# EasyEDA Pro project ProProject_New Project_2023-08-26_19-08-02_2023-08-26.epro

# Schematic Schematic1
Create Date: 2023-08-26; Page Name: P1; Project Name: New Project_2023-08-26_19-08-02; Schematic Name: Schematic1; Update Date: 2023-08-26; Company: 嘉立创EDA; Page Size: A4; Version: V1.0
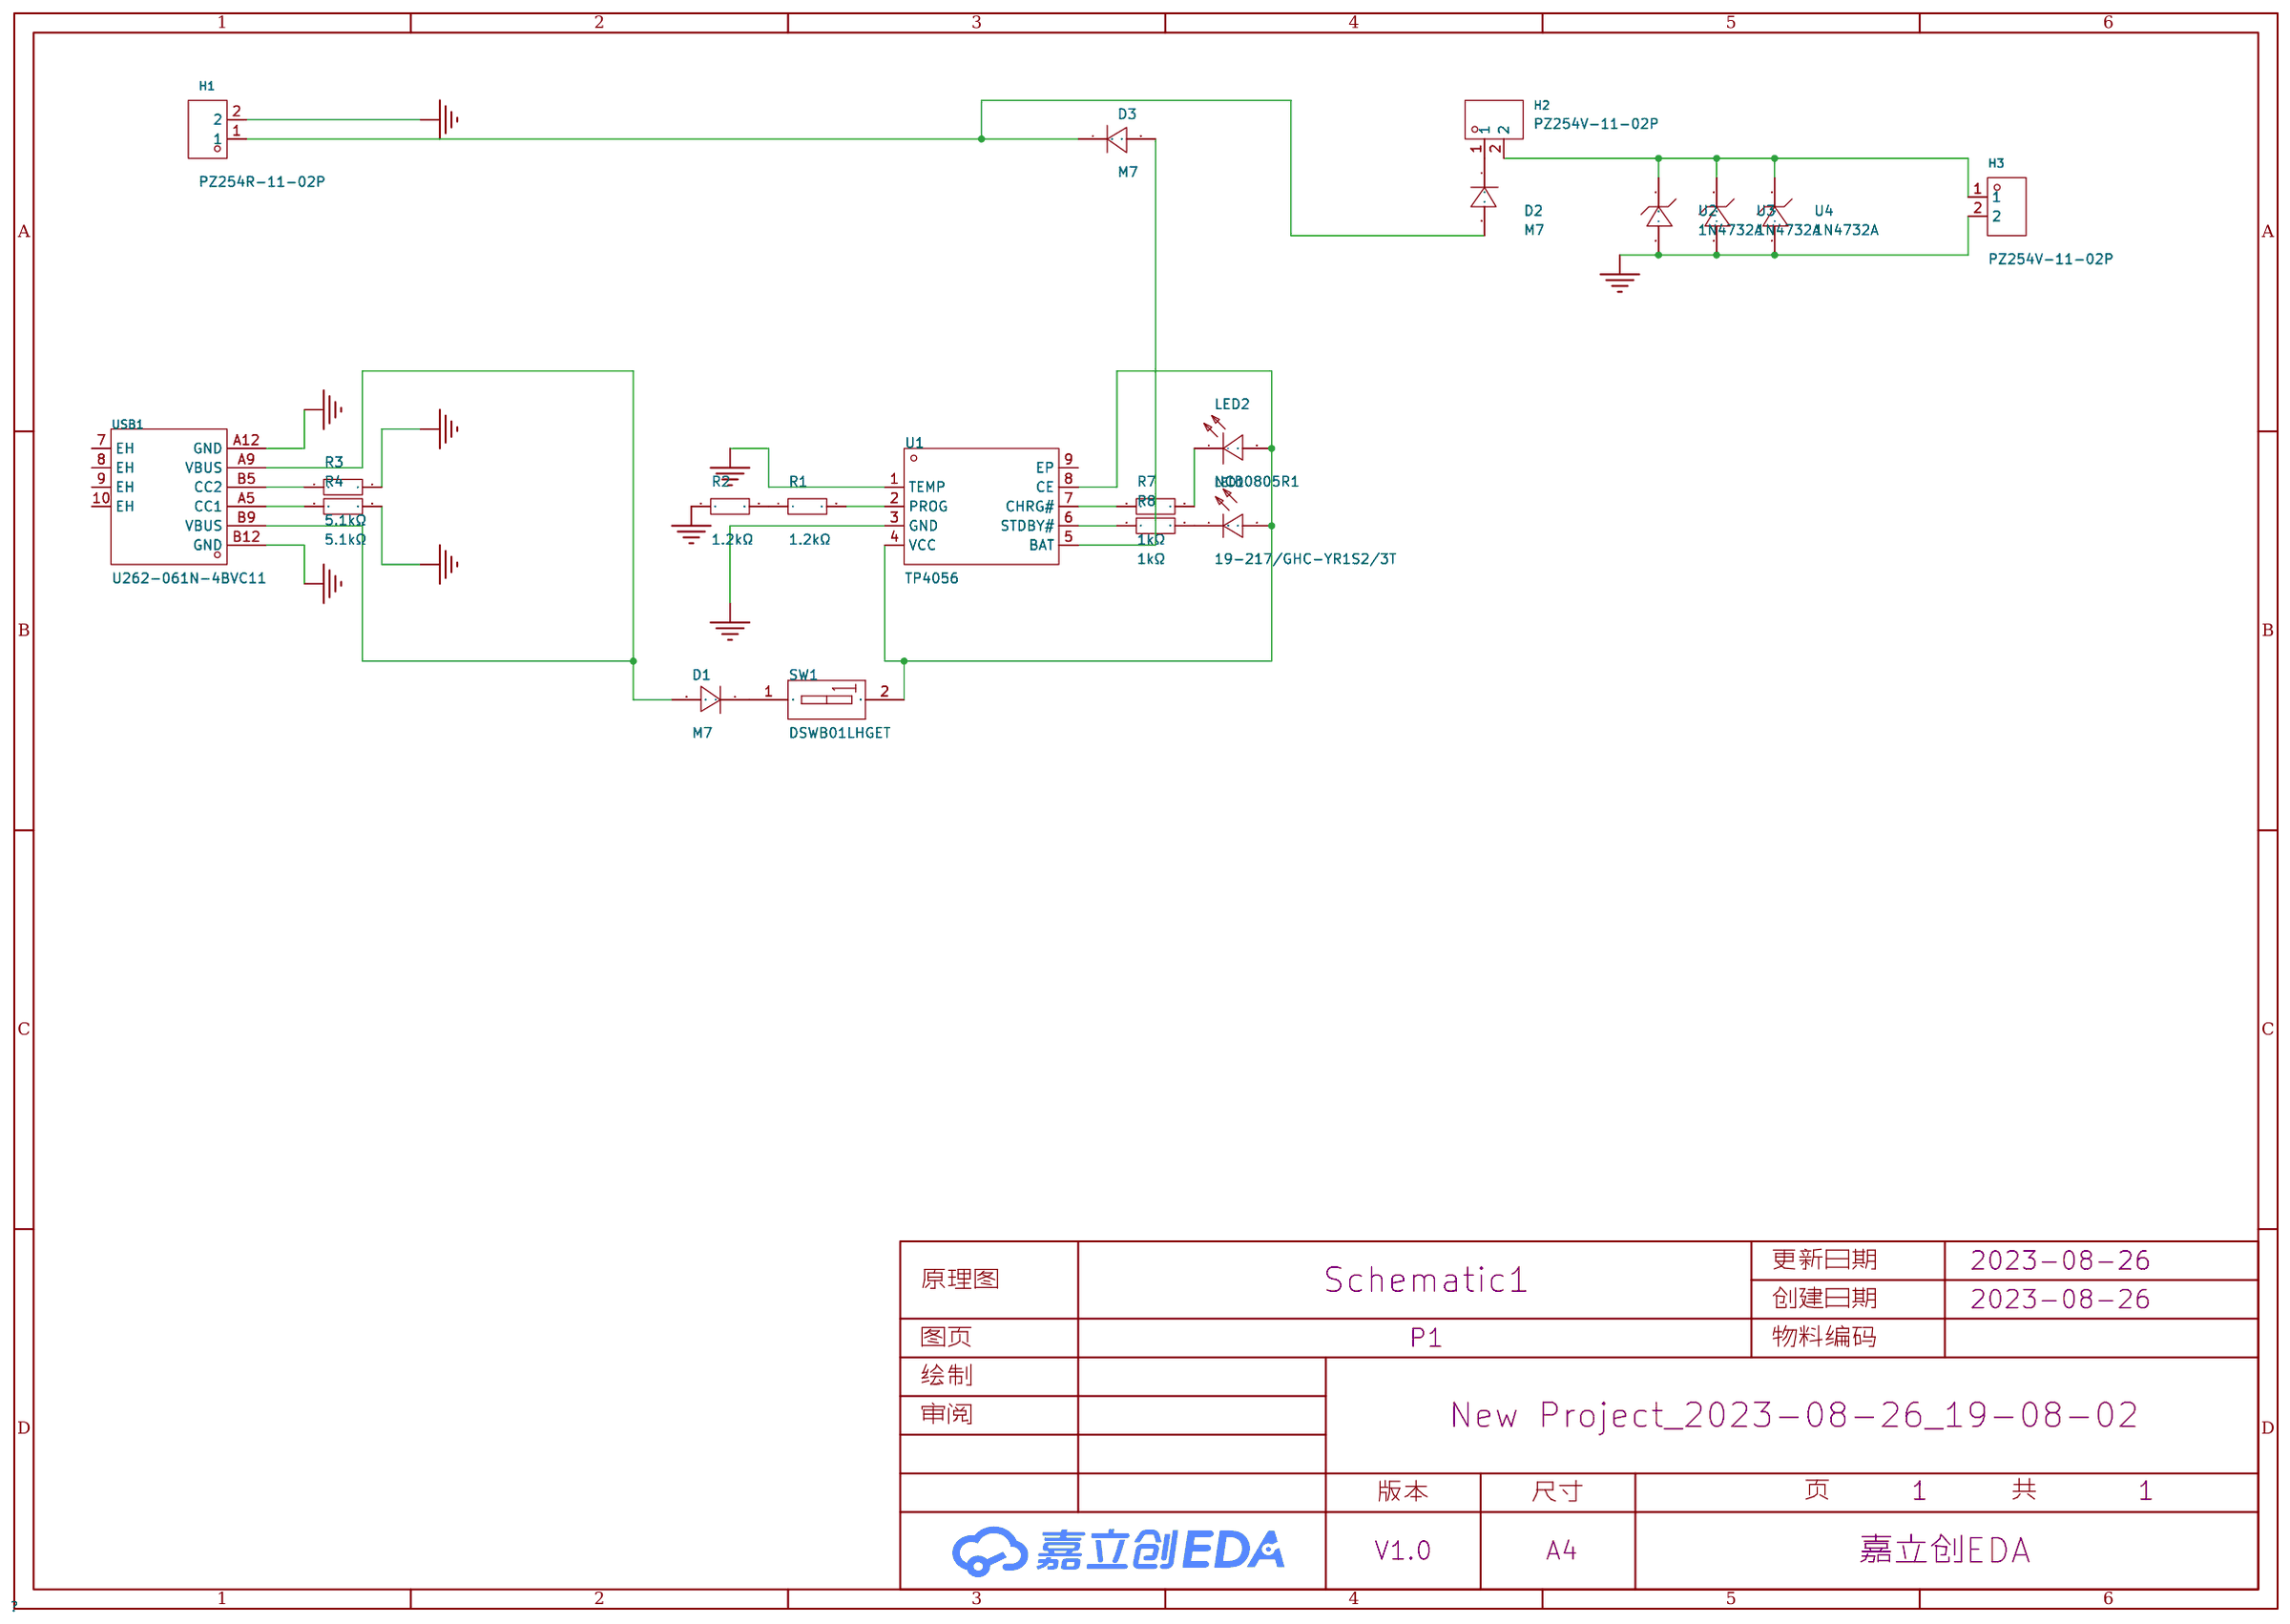
[diagram p0: schematic sheet]

## Parts
D1  M7  [SMA_L4.3-W2.6-LS5.2-RD]
D2  M7  [SMA_L4.3-W2.6-LS5.2-RD]
D3  M7  [SMA_L4.3-W2.6-LS5.2-RD]
H1  PZ254R-11-02P  [HDR-TH_2P-P2.54-H-M-W10.4]
H2  PZ254V-11-02P  [HDR-TH_2P-P2.54-V-M]
H3  PZ254V-11-02P  [HDR-TH_2P-P2.54-V-M]
LED1  19-217/GHC-YR1S2/3T  [LED0603-RD]
LED2  NCD0805R1  [LED0805-RD_RED]
R1  1.2kΩ  [R0603]
R2  1.2kΩ  [R0603]
R3  5.1kΩ  [R0603]
R4  5.1kΩ  [R0603]
R7  1kΩ  [R0603]
R8  1kΩ  [R0603]
SW1  DSWB01LHGET  [SW-TH_DSWB01LHGET]
U1  TP4056  [ESOP-8_L4.9-W3.9-P1.27-LS6.0-BL-EP]
U2  1N4732A  [DO-41_BD2.4-L4.7-P8.70-D0.9-RD]
U3  1N4732A  [DO-41_BD2.4-L4.7-P8.70-D0.9-RD]
U4  1N4732A  [DO-41_BD2.4-L4.7-P8.70-D0.9-RD]
USB1  U262-061N-4BVC11  [USB-SMD_U262-061N-4BVC11]

## Library data of the parts
D1-D3 = M7_C95872: 二极管配置:-;直流反向耐压(Vr):1kV;平均整流电流(Io):1A;正向压降(Vf):1.1V@1A;反向电流(Ir):5uA@1kV;; LCSC Part Name: 1kV 1A 1.1V@1A; Supplier Part: C95872; Manufacturer: MDD; Supplier Footprint: SMA(DO-214AC); JLCPCB Part Class: 基础库; Datasheet: https://atta.szlcsc.com/upload/public/pdf/source/20170221/1487670316366.pdf; Supplier: LCSC; Reverse Voltage (Vr): 1kV; Average Rectified Current (Io): 1A; Forward Voltage (Vf@If): 1.1V@1A; Reverse Leakage Current: 5uA@1kV
H1 = PZ254R-11-02P: 排数:单排;总PIN位数:2P;间距:2.54mm;插针结构:1x2P;行距:-;安装类型:弯插;圆针/方针:方针;额定电流:-;额定电压:-;配合针长度:6mm;塑高:2.5mm;触头材质:黄铜;触头镀层:-;工作温度范围:-40℃~+105℃;颜色:黑色;; LCSC Part Name: 2.54mm 1x2P 弯插 方针; Supplier Part: C492410; Manufacturer: XFCN(兴飞); Supplier Footprint: 弯插,P=2.54mm; JLCPCB Part Class: 扩展库; Datasheet: https://atta.szlcsc.com/upload/public/pdf/source/20200309/C492410_AD20A982E51A4870F6FD4D2413672598.pdf; Supplier: LCSC; Number of Rows: 单排; Number of Pins: 2P; Pitch: 2.54mm; Pin Structure: 1x2P; Mounting Type: 弯插; Circluar Pins/Square Pins: 方针; Length of Mating Pin: 6mm; Insulation Height: 2.5mm; Contact Material: 黄铜; Operating Temperature Range: -40℃~+105℃; Color: 黑色
H2 H3 = PZ254V-11-02P: 排数:单排;总PIN位数:2P;间距:2.54mm;插针结构:1x2P;行距:-;安装类型:直插;圆针/方针:方针;额定电流:-;额定电压:-;配合针长度:6mm;塑高:2.5mm;端接针长度:3mm;触头材质:黄铜;触头镀层:-;工作温度范围:-40℃~+105℃;颜色:黑色;; LCSC Part Name: 2.54mm 1x2P 直插 方针; Supplier Part: C492401; Manufacturer: XFCN(兴飞); Supplier Footprint: 插件,P=2.54mm; JLCPCB Part Class: 扩展库; Datasheet: https://atta.szlcsc.com/upload/public/pdf/source/20200309/C492401_A812433581A9B211A7FFA413ADDFF0E5.pdf; Supplier: LCSC; Number of Rows: 单排; Number of Pins: 2P; Pitch: 2.54mm; Pin Structure: 1x2P; Mounting Type: 直插; Circluar Pins/Square Pins: 方针; Length of Mating Pin: 6mm; Insulation Height: 2.5mm; Length of End Connection Pin: 3mm; Contact Material: 黄铜; Operating Temperature Range: -40℃~+105℃; Color: 黑色
LED1 = 19-217/GHC-YR1S2/3T: 发光颜色:翠绿;二极管配置:-;主波长:520nm~535nm;色温:-;功率:110mW;安装方式:-;; LCSC Part Name: 翠绿; Supplier Part: C72043; Manufacturer: EVERLIGHT(亿光); Supplier Footprint: 0603; JLCPCB Part Class: Basic Part; Datasheet: https://atta.szlcsc.com/upload/public/pdf/source/20160507/1462613613780.pdf; Supplier: LCSC; Emitted Color: 翠绿; Lens Color: 无色透明; Dominant Wavelength: 520nm~535nm; Peak Wavelength: 518nm; Forward Current: 20mA; Power Dissipation: 110mW; Viewing Angle: 120°; Operating Temperature: -40℃~+85℃
LED2 = NCD0805R1: 发光颜色:红灯;; LCSC Part Name: 红灯; Supplier Part: C84256; Manufacturer: 国星光电; Supplier Footprint: 0805; JLCPCB Part Class: Basic Part; Datasheet: https://atta.szlcsc.com/upload/public/pdf/source/20200820/C84256_F0A75A43B3EAD75808600A0514C76B99.pdf; Supplier: LCSC; Emitted Color: 红灯
R1 R2 = 0603WAF1201T5E: 电阻类型:厚膜电阻;阻值:1.2kΩ;精度:±1%;功率:100mW;; LCSC Part Name: 1.2kΩ ±1% 100mW; Supplier Part: C22765; Manufacturer: UNI-ROYAL(厚声); Supplier Footprint: 0603; JLCPCB Part Class: 基础库; Datasheet: https://atta.szlcsc.com/upload/public/pdf/source/20200306/C422600_1E6D84923E4A46A82E41ADD87F860B5C.pdf; Supplier: LCSC; Type: 厚膜电阻; Tolerance: ±1%; Power(Watts): 100mW; Temperature Coefficient: ±100ppm/℃; Overload Voltage (Max): 75V; Operating Temperature Range: -55℃~+155℃
R3 R4 = 0603WAF5101T5E: 电阻类型:厚膜电阻;阻值:5.1kΩ;精度:±1%;功率:100mW;; LCSC Part Name: 5.1kΩ ±1% 100mW; Supplier Part: C23186; Manufacturer: UNI-ROYAL(厚声); Supplier Footprint: 0603; JLCPCB Part Class: 基础库; Datasheet: https://atta.szlcsc.com/upload/public/pdf/source/20200306/C422600_1E6D84923E4A46A82E41ADD87F860B5C.pdf; Supplier: LCSC; Type: 厚膜电阻; Tolerance: ±1%; Power(Watts): 100mW; Temperature Coefficient: ±100ppm/℃; Overload Voltage (Max): 75V; Operating Temperature Range: -55℃~+155℃
R7 R8 = 0603WAF1001T5E: 电阻类型:厚膜电阻;阻值:1kΩ;精度:±1%;功率:100mW;; LCSC Part Name: 1kΩ ±1% 100mW; Supplier Part: C21190; Manufacturer: UNI-ROYAL(厚声); Supplier Footprint: 0603; JLCPCB Part Class: Basic Part; Datasheet: https://atta.szlcsc.com/upload/public/pdf/source/20200306/C422600_1E6D84923E4A46A82E41ADD87F860B5C.pdf; Supplier: LCSC; Type: 厚膜电阻; Tolerance: ±1%; Power(Watts): 100mW; Temperature Coefficient: ±100ppm/℃; Overload Voltage (Max): 75V; Operating Temperature Range: -55℃~+155℃
SW1 = DSWB01LHGET: 类型:平拨,凸起式;电路结构:单刀单掷;开关位数:1;使用寿命:-;颜色:红色;; LCSC Part Name: 红色宽体1位顶拨插件; Supplier Part: C126888; Manufacturer: YE; Supplier Footprint: 插件; JLCPCB Part Class: 扩展库; Datasheet: https://atta.szlcsc.com/upload/public/pdf/source/20170824/C126888_1503565979649906649.pdf; Supplier: LCSC; Type: 平拨,凸起式; Circuit: 单刀单掷; Number of Positions: 1; Color: 红色
U1 = TP4056_C725790: Supplier Part: C725790; Manufacturer: UMW(友台半导体); Supplier Footprint: ESOP-8; JLCPCB Part Class: 扩展库; Datasheet: https://atta.szlcsc.com/upload/public/pdf/source/20211011/37515E71BA298E23D23475482C49633D.pdf; Supplier: LCSC
U2-U4 = 1N4732A: This is a complete series of 1 Watt Zener diode with limits and excellent operating characteristics that reflect the superior capabilities of silicon-oxide passivated junctions. All this in an axial-lead hermetically sealed glass package that offers prote; LCSC Part Name: 1N4732A Zener 1W 5%; Supplier Part: C890042; Manufacturer: onsemi(安森美); Supplier Footprint: 插件,D2.03xL4.06mm; JLCPCB Part Class: 扩展库; Datasheet: https://atta.szlcsc.com/upload/public/pdf/source/20221020/ED14C0897A7B8AED5ABCCF0A94CC169C.pdf; Supplier: LCSC
USB1 = U262-061N-4BVC11: 连接器类型:Type-C;标准:USB 3.1;公母:母座;触点数量:6P;端口数量:1;安装方式:卧贴;额定电流 - 电源:5A;触头材质:铜合金;触头镀层:金;工作温度范围:-25℃~+85℃;焊接温度(最大值):260℃;; LCSC Part Name: Type-C 母座 卧贴; Supplier Part: C2764612; Manufacturer: XKB Connectivity(中国星坤); Supplier Footprint: SMD; JLCPCB Part Class: Extended Part; Datasheet: https://atta.szlcsc.com/upload/public/pdf/source/20210602/C2764612_915BA3D27A0B76A9D989108E3A082B29.pdf; Supplier: LCSC; Connector Type: Type-C; Standard: USB 3.1; Gender: 母座; Number of Contacts: 6P; Number of Ports: 1; Mounting Style: 卧贴; Current Rating - Power (Max): 5A; Contact Material: 铜合金; Contact Plating: 金; Operating Temperature Range: -25℃~+85℃; Welding Temperature (Max): 260℃

## Nets
GND: H1.2 H3.2 R2.1 R3.2 R4.2 U1.1(TEMP) U1.3(GND) U2.2(A) U3.2(A) U4.2(A) USB1.A12(GND) USB1.B12(GND)
$1N658: R1.2 U1.2(PROG)
$1N702: R1.1 R2.2
$1N1061: R3.1 USB1.B5(CC2)
$1N1064: R4.1 USB1.A5(CC1)
$1N1096: D3.2(A) U1.5(BAT)
$1N1303: LED2.1(-) R7.2
$1N1412: D1.2(A) USB1.A9(VBUS) USB1.B9(VBUS)
$1N1476: D1.1(K) SW1.1(A1)
$1N1516: LED1.2(A) LED2.2(+) SW1.2 U1.4(VCC) U1.8(CE)
$1N1728: LED1.1(C) R8.2
$1N1769: R7.1 U1.7(CHRG#)
$1N1772: R8.1 U1.6(STDBY#)
$1N1946: D2.1(K) H2.1
$1N2058: D2.2(A) D3.1(K) H1.1
$1N2374: H2.2 H3.1 U2.1(C) U3.1(C) U4.1(C)

Not connected (* = marked no-connect by the designer): U1 9(EP); USB1 7(EH) 8(EH) 9(EH) 10(EH)

# Board PCB1
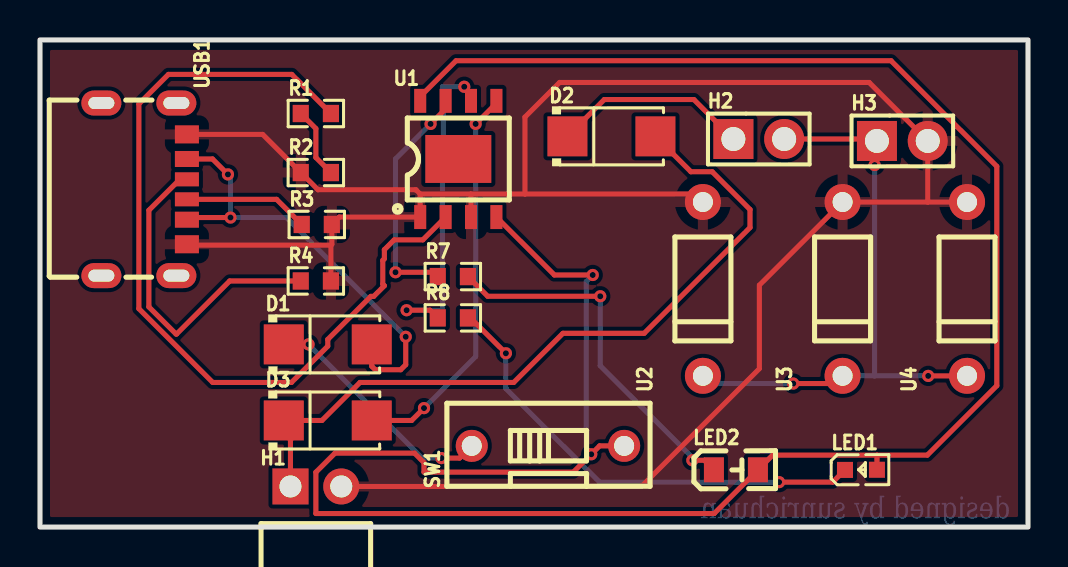
[diagram p1: board, top side]
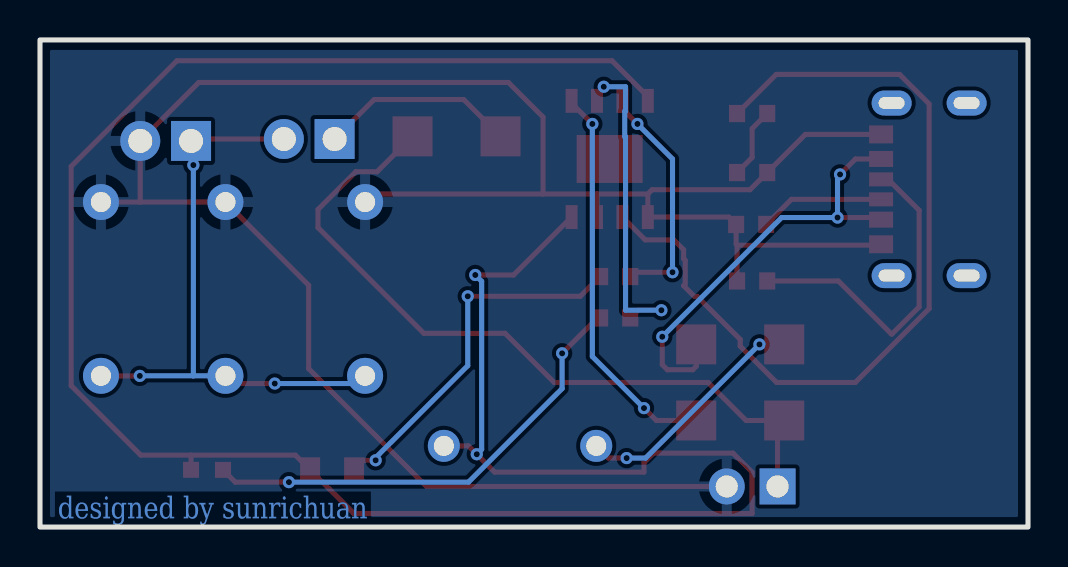
[diagram p2: board, bottom side, seen from below]

Outline 49.4 x 24.38 mm; copper layers: Top Layer, Bottom Layer. Coordinates in mm from the lower left corner of the outline.
Outline path: rectangle 0,24.38 49.4,0
Stack: Top Layer 0.035mm / Dielectric1 1.51mm FR4 er 4.5 / Bottom Layer 0.035mm

## Design rules (mm)
template: JLCPCB Capability(Two Layers Board)
spacing copperThickness1oz (default): track to track 0.102, other pairs 0.152 to 0.3
spacing copperThickness2oz: track to track 0.203, other pairs 0.152 to 0.3
track width copperThickness1oz (default): min 0.127, default 0.254, max 2.54
track width copperThickness2oz: min 0.203, default 0.254, max 2.54
differential pair differentialPair (default): width min 0.127, default 0.254, max 2.54; gap min 0.152, default 0.152
via viaSize (default): diameter min 0.5, default 0.61, max 10; hole min 0.3, default 0.305, max 6.3

## Placement (name value [footprint] x y rotation side)
D1  M7  [SMA_L4.3-W2.6-LS5.2-RD]  14.39 9.14 0 top
D2  M7  [SMA_L4.3-W2.6-LS5.2-RD]  28.57 19.56 0 top
D3  M7  [SMA_L4.3-W2.6-LS5.2-RD]  14.39 5.33 0 top
H1  PZ254R-11-02P  [HDR-TH_2P-P2.54-H-M-W10.4]  13.79 2.03 0 top
H2  PZ254V-11-02P  [HDR-TH_2P-P2.54-V-M]  35.94 19.42 0 top
H3  PZ254V-11-02P  [HDR-TH_2P-P2.54-V-M]  43.12 19.33 0 top
LED1  19-217/GHC-YR1S2/3T  [LED0603-RD]  41.05 2.86 0 top
LED2  NCD0805R1  [LED0805-RD_RED]  34.8 2.86 0 top
R1  1.2kΩ  [R0603]  13.79 20.7 0 top
R2  1.2kΩ  [R0603]  13.79 17.75 0 top
R3  5.1kΩ  [R0603]  13.84 15.15 0 top
R4  5.1kΩ  [R0603]  13.79 12.32 0 top
R7  1kΩ  [R0603]  20.64 12.54 0 top
R8  1kΩ  [R0603]  20.64 10.47 0 top
SW1  DSWB01LHGET  [SW-TH_DSWB01LHGET]  25.4 4.06 90 top
U1  TP4056  [ESOP-8_L4.9-W3.9-P1.27-LS6.0-BL-EP]  20.92 18.43 0 top
U2  1N4732A  [DO-41_BD2.4-L4.7-P8.70-D0.9-RD]  33.15 11.92 90 top
U3  1N4732A  [DO-41_BD2.4-L4.7-P8.70-D0.9-RD]  40.13 11.92 90 top
U4  1N4732A  [DO-41_BD2.4-L4.7-P8.70-D0.9-RD]  46.35 11.92 90 top
USB1  U262-061N-4BVC11  [USB-SMD_U262-061N-4BVC11]  5.21 16.91 270 top

## Footprints (pads in the part's own frame, mm; a bottom-side part is the same pattern mirrored in y, then rotated)
DO-41_BD2.4-L4.7-P8.70-D0.9-RD
  round 1.8 hole 1: 1(-4.35,0) 2(4.35,0)
ESOP-8_L4.9-W3.9-P1.27-LS6.0-BL-EP
  rect 0.6x1.2 smd: 1(-1.905,-2.909) 2(-0.635,-2.909) 3(0.635,-2.909) 4(1.905,-2.909) 5(1.905,2.909) 6(0.635,2.909) 7(-0.635,2.909) 8(-1.905,2.909)
  rect 3.3x2.4 smd: 9(0,0)
HDR-TH_2P-P2.54-H-M-W10.4
  rect 1.8x1.8 hole 1.1: 1(-1.27,0)
  round 1.8 hole 1.1: 2(1.27,0)
HDR-TH_2P-P2.54-V-M
  rect 2x2 hole 1.2: 1(-1.27,0)
  round 2 hole 1.2: 2(1.27,0)
LED0603-RD
  rect 0.8x0.8 smd: 1(-0.799,-0.004) 2(0.799,0.004)
LED0805-RD_RED
  rect 1x1.25 smd: 1(-1.1,0) 2(1.1,0)
R0603
  rect 0.806x0.864 smd: 1(-0.753,0) 2(0.753,0)
SMA_L4.3-W2.6-LS5.2-RD
  rect 2x2 smd: 1(-2.2,0) 2(2.2,0)
SW-TH_DSWB01LHGET
  round 1.6 hole 1: 1(0,3.81) 2(0,-3.81)
USB-SMD_U262-061N-4BVC11
  oval 1.25x2 hole 0.6x1.3: 7(-4.32,1.611) 8(4.32,1.611) 9(-4.32,-2.139) 10(4.32,-2.139)
  rect 0.7x1.2 smd: A5(-0.5,2.139) B5(0.5,2.139)
  rect 0.8x1.2 smd: A9(1.52,2.139) B9(-1.52,2.139)
  rect 0.9x1.2 smd: A12(2.75,2.139) B12(-2.75,2.139)

## Nets
As in the schematic.

Pads without a net: U1 9; USB1 7 8 9 10

## Via types
v1: diameter 0.61, hole 0.305, Top Layer to Bottom Layer, 20 vias

## Routing (per net, layer and track width the routed paths; a pad name or vN(x,y) marks a point on that pad's centre or on a via; arc(x,y) is an arc through that point)
GND: length 112.8
  Top Layer w0.254: 24.25,16.67 24.25,20.52 25.98,22.26 41.46,22.26 H3.2 44.39,16.27 ; 24.25,16.67 32.75,16.67 U2.2 ; 24.25,16.67 21.55,16.67 ; H1.2 30.07,2.03 35.97,7.93 35.97,12.11 U3.2 44.39,16.27 ; 19.01,16.67 U1.1 14.96,15.52 R3.2 14.59,14.15 14.55,14.11 ; 19.01,16.67 18.8,16.89 13.9,16.89 R2.1 11.13,19.66 USB1.B12 ; 19.01,16.67 21.55,16.67 ; 14.55,14.11 R4.2 ; 14.55,14.11 7.39,14.11 USB1.A12 ; 44.39,16.27 U4.2 ; 21.55,16.67 U1.3
$1N658: length 42.9
  Top Layer w0.254: U1.2 19.14,14.38 17.71,14.38 17.22,13.88 17.22,13.43 17.14,13.35 17.14,12.16 17.22,12.08 16.69,11.55 16.54,11.55 14.39,9.39 14.39,9.06 12.57,7.24 8.64,7.24 4.94,10.93 4.94,21.18 6.42,22.66 12.59,22.66 R1.2
$1N702: length 3.6
  Top Layer w0.254: R1.1 13.79,19.95 13.79,18.5 R2.2
$1N1061: length 6.3
  Top Layer w0.254: R3.1 11.83,16.41 USB1.B5
$1N1064: length 16.6
  Top Layer w0.254: R4.1 9.49,12.32 6.83,9.66 6.8,9.66 5.44,11.02 5.44,15.86 6.99,17.41 USB1.A5
$1N1096: length 19.7
  Top Layer w0.254: U1.5 22.82,21.22 v1(21.78,20.18) ; D3.2 18.58,5.33 v1(19.2,5.95)
  Bottom Layer w0.254: v1(19.2,5.95) 21.78,8.54 v1(21.78,20.18)
$1N1303: length 18.4
  Top Layer w0.254: LED2.1 33.22,3.34 v1(32.62,3.34) ; v1(28.01,11.55) 22.38,11.55 R7.2
  Bottom Layer w0.254: v1(28.01,11.55) 28.01,8.08 32.62,3.47 v1(32.62,3.34)
$1N1412: length 22.4
  Top Layer w0.254: v1(9.4,17.65) 8.62,18.43 USB1.B9 ; v1(9.53,15.49) 7.45,15.49 USB1.A9 ; D1.2 16.59,8.05 16.76,7.87 18.03,7.87 18.29,8.13 v1(18.29,9.52)
  Bottom Layer w0.254: v1(18.29,9.52) 12.32,15.49 v1(9.53,15.49) 9.53,17.53 v1(9.4,17.65)
$1N1476: length 12
  Top Layer w0.254: SW1.1 20.98,3.45 v1(20.07,3.45) ; D1.1 v1(13.43,9.14)
  Bottom Layer w0.254: v1(13.43,9.14) 19.12,3.45 v1(20.07,3.45)
$1N1516: length 114.7
  Top Layer w0.254: 41.85,3.6 LED1.2 ; 41.85,3.6 36.63,3.6 LED2.2 33.71,0.68 13.79,0.68 13.79,2.74 14.75,3.7 18.73,3.7 19.2,3.22 19.2,2.75 26.67,2.75 v1(27.56,3.64) 27.98,4.06 SW1.2 ; 41.85,3.6 44.37,3.6 47.84,7.08 47.84,18.05 42.55,23.34 20.8,23.34 19.01,21.55 U1.8 ; v1(27.64,12.62) 25.72,12.62 U1.4
  Bottom Layer w0.254: v1(27.64,12.62) 27.32,12.3 27.32,3.89 v1(27.56,3.64)
$1N1728: length 23.5
  Top Layer w0.254: LED1.1 39.64,2.25 v1(36.96,2.25) ; v1(23.3,8.7) 21.52,10.47 R8.2
  Bottom Layer w0.254: v1(23.3,8.7) 23.3,6.93 27.98,2.25 v1(36.96,2.25)
$1N1769: length 11.8
  Top Layer w0.254: U1.7 20.28,20.93 v1(19.53,20.18) ; R7.1 19.67,12.75 v1(17.78,12.75)
  Bottom Layer w0.254: v1(17.78,12.75) 17.78,18.43 v1(19.53,20.18)
$1N1772: length 16.7
  Top Layer w0.254: v1(18.33,10.85) 19.51,10.85 R8.1 ; U1.6 21.55,21.7 v1(21.21,22.04)
  Bottom Layer w0.254: v1(21.21,22.04) 20.12,22.04 20.12,20.82 20.17,20.82 20.17,19.54 20.12,19.54 20.12,10.85 v1(18.33,10.85)
$1N1946: length 9.9
  Top Layer w0.254: D2.1 28.22,21.4 32.69,21.4 H2.1
$1N2058: length 37.8
  Top Layer w0.254: D2.2 32.55,17.79 33.61,17.79 35.5,15.9 35.5,14.99 30.21,9.7 26.15,9.7 23.69,7.24 16,7.24 14.1,5.33 12.52,5.33 ; 12.52,5.33 D3.1 ; 12.52,5.33 H1.1
$1N2374: length 30
  Top Layer w0.254: v1(37.66,7.18) 39.75,7.18 U3.1 ; v1(41.73,18.12) 41.73,19.21 H3.1 41.75,19.42 H2.2 ; U4.1 46.35,7.57 v1(44.41,7.57)
  Bottom Layer w0.254: U3.1 41.73,7.57 ; 41.73,7.57 44.41,7.57 v1(44.41,7.57) ; 41.73,7.57 v1(41.73,18.12) ; U2.1 33.53,7.18 v1(37.66,7.18)

## Copper pours and planes (outline as drawn; the poured copper is in the pictures)
GND on Top Layer: -3.68,26.92 -3.68,0.51 1.52,-4.7 47.5,-4.7 53.72,1.52 53.72,22.86 47.5,29.08 -1.52,29.08
GND on Bottom Layer: 57.15,28.96 57.15,-0.25 44.07,-13.34 0.51,-13.34 -18.54,5.72 -9.14,15.11 -9.14,34.67 50.29,34.67 56.77,28.19 56.77,28.58

## Text on the board
Bottom Layer: designed by sunrichuan
